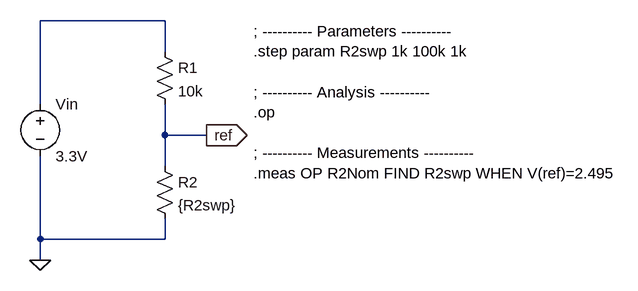
[diagram p0: schematic Stage02_TB_Divider.asc]
Stage02_TB_Divider.asc, the LTspice schematic file:
Version 4.1
SHEET 1 1112 680
WIRE 288 16 96 16
WIRE 288 64 288 16
WIRE 96 144 96 16
WIRE 288 192 288 144
WIRE 352 192 288 192
WIRE 288 240 288 192
WIRE 96 352 96 224
WIRE 288 352 288 320
WIRE 288 352 96 352
WIRE 96 384 96 352
FLAG 96 384 0
FLAG 352 192 ref
IOPIN 352 192 Out
SYMBOL voltage 96 128 R0
SYMATTR InstName Vin
SYMATTR Value 3.3V
SYMBOL res 272 48 R0
SYMATTR InstName R1
SYMATTR Value 10k
SYMBOL res 272 224 R0
SYMATTR InstName R2
SYMATTR Value {R2swp}
TEXT 424 32 Left 2 !; ---------- Parameters ----------\n.step param R2swp 1k 100k 1k\n \n; ---------- Analysis ----------\n.op \n \n; ---------- Measurements ----------\n.meas OP R2Nom FIND R2swp WHEN V(ref)=2.495

The netlist it stands for:
* Stage02_TB_Divider.asc
Vin N001 0 3.3V
R1 N001 ref 10k
R2 ref 0 {R2swp}
; ---------- Parameters ----------
.step param R2swp 1k 100k 1k
; ---------- Analysis ----------
.op
; ---------- Measurements ----------
.meas OP R2Nom FIND R2swp WHEN V(ref)=2.495
.backanno
.end

* Results of the author's LTspice run, read from the files saved beside the schematic
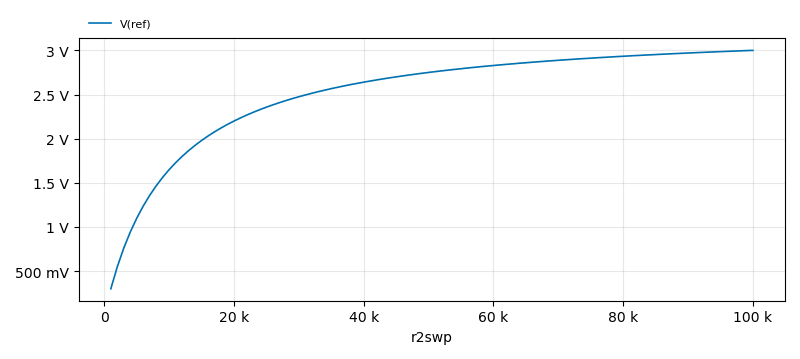
[diagram p1: Operating Point of Stage02_TB_Divider.asc, plotted from the saved traces]
* Operating Point, 1 run:
*   V(ref): 300 mV at r2swp=1 k, 3 V at r2swp=100 k, min 300 mV, max 3 V
* From the log:
*   r2nom: R2swp=30993.9391929 at 30993.9391929